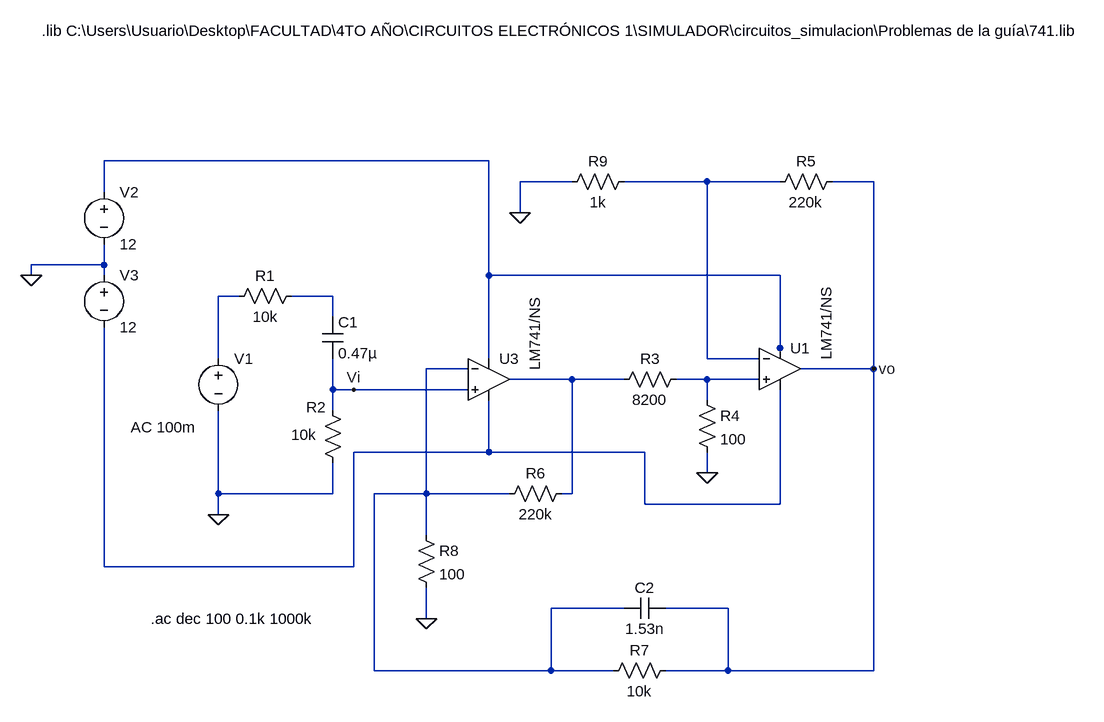
[diagram p0: schematic circuito.asc]
circuito.asc, the LTspice schematic file:
Version 4
SHEET 1 1612 680
WIRE 576 -176 -16 -176
WIRE 704 -144 624 -144
WIRE 912 -144 784 -144
WIRE 1024 -144 912 -144
WIRE 1168 -144 1104 -144
WIRE -16 -128 -16 -176
WIRE 624 -96 624 -144
WIRE -16 -16 -16 -48
WIRE -16 -16 -128 -16
WIRE -128 0 -128 -16
WIRE -16 0 -16 -16
WIRE 576 0 576 -176
WIRE 1024 0 576 0
WIRE 192 32 160 32
WIRE 336 32 272 32
WIRE 336 64 336 32
WIRE 1024 112 1024 0
WIRE 160 128 160 32
WIRE 576 128 576 0
WIRE 912 128 912 -144
WIRE 992 128 912 128
WIRE 1024 128 1024 112
WIRE 544 144 480 144
WIRE 1168 144 1168 -144
WIRE 1168 144 1056 144
WIRE 704 160 608 160
WIRE 784 160 704 160
WIRE 912 160 864 160
WIRE 992 160 912 160
WIRE 336 176 336 128
WIRE 368 176 336 176
WIRE 544 176 368 176
WIRE 912 192 912 160
WIRE 336 208 336 176
WIRE 576 272 576 192
WIRE 576 272 368 272
WIRE 816 272 576 272
WIRE 912 304 912 272
WIRE 160 336 160 208
WIRE 336 336 336 288
WIRE 336 336 160 336
WIRE 480 336 480 144
WIRE 480 336 400 336
WIRE 608 336 480 336
WIRE 704 336 704 160
WIRE 704 336 688 336
WIRE 816 352 816 272
WIRE 1024 352 1024 176
WIRE 1024 352 816 352
WIRE 160 368 160 336
WIRE 480 400 480 336
WIRE -16 448 -16 80
WIRE 368 448 368 272
WIRE 368 448 -16 448
WIRE 784 512 672 512
WIRE 944 512 848 512
WIRE 480 528 480 480
WIRE 400 608 400 336
WIRE 672 608 672 512
WIRE 672 608 400 608
WIRE 768 608 672 608
WIRE 944 608 944 512
WIRE 944 608 848 608
WIRE 1168 608 1168 144
WIRE 1168 608 944 608
FLAG 160 368 0
FLAG 912 304 0
FLAG 624 -96 0
FLAG 480 528 0
FLAG 368 176 Vi
FLAG -128 0 0
FLAG 1168 144 vo
SYMBOL voltage 160 112 R0
WINDOW 123 -135 122 Left 2
WINDOW 39 0 0 Left 0
SYMATTR Value2 AC 100m
SYMATTR InstName V1
SYMATTR Value ""
SYMBOL res 288 16 R90
WINDOW 0 0 56 VBottom 2
WINDOW 3 32 56 VTop 2
SYMATTR InstName R1
SYMATTR Value 10k
SYMBOL res 320 192 R0
WINDOW 0 -25 11 Left 2
WINDOW 3 -48 53 Left 2
SYMATTR InstName R2
SYMATTR Value 10k
SYMBOL cap 320 64 R0
SYMATTR InstName C1
SYMATTR Value 0.47µ
SYMBOL res 880 144 R90
WINDOW 0 0 56 VBottom 2
WINDOW 3 32 56 VTop 2
SYMATTR InstName R3
SYMATTR Value 8200
SYMBOL res 1120 -160 R90
WINDOW 0 0 56 VBottom 2
WINDOW 3 32 56 VTop 2
SYMATTR InstName R5
SYMATTR Value 220k
SYMBOL res 704 320 R90
WINDOW 0 0 56 VBottom 2
WINDOW 3 32 56 VTop 2
SYMATTR InstName R6
SYMATTR Value 220k
SYMBOL res 864 592 R90
WINDOW 0 0 56 VBottom 2
WINDOW 3 32 56 VTop 2
SYMATTR InstName R7
SYMATTR Value 10k
SYMBOL res 464 384 R0
SYMATTR InstName R8
SYMATTR Value 100
SYMBOL res 896 176 R0
SYMATTR InstName R4
SYMATTR Value 100
SYMBOL res 800 -160 R90
WINDOW 0 0 56 VBottom 2
WINDOW 3 32 56 VTop 2
SYMATTR InstName R9
SYMATTR Value 1k
SYMBOL OpAmps\\opamp2 576 96 R0
WINDOW 3 71 50 VLeft 2
SYMATTR Value LM741/NS
SYMATTR InstName U3
SYMBOL voltage -16 -144 R0
WINDOW 123 0 0 Left 0
WINDOW 39 0 0 Left 0
SYMATTR InstName V2
SYMATTR Value 12
SYMBOL voltage -16 -16 R0
WINDOW 123 0 0 Left 0
WINDOW 39 0 0 Left 0
SYMATTR InstName V3
SYMATTR Value 12
SYMBOL OpAmps\\opamp2 1024 80 R0
WINDOW 3 71 50 VLeft 2
SYMATTR Value LM741/NS
SYMATTR InstName U1
SYMBOL cap 848 496 R90
WINDOW 0 0 32 VBottom 2
WINDOW 3 32 32 VTop 2
SYMATTR InstName C2
SYMATTR Value 1.53n
TEXT 56 528 Left 2 !.ac dec 100 0.1k 1000k
TEXT -112 -376 Left 2 !.lib C:\\Users\\Usuario\\Desktop\\FACULTAD\\4TO AÑO\\CIRCUITOS ELECTRÓNICOS 1\\SIMULADOR\\circuitos_simulacion\\Problemas de la guía\\741.lib

The netlist it stands for:
* circuito.asc
V1 N003 0 AC 100m
R1 N004 N003 10k
R2 Vi 0 10k
C1 N004 Vi 0.47µ
R3 N007 N006 8200
R5 vo N002 220k
R6 N006 N005 220k
R7 vo N005 10k
R8 N005 0 100
R4 N007 0 100
R9 N002 0 1k
XU3 Vi N005 N001 N008 N006 LM741/NS  ; pins In+ In- V+ V- OUT
V2 N001 0 12
V3 0 N008 12
XU1 N007 N002 N001 N008 vo LM741/NS  ; pins In+ In- V+ V- OUT
C2 vo N005 1.53n
.ac dec 100 0.1k 1000k
.lib C:\Users\Usuario\Desktop\FACULTAD\4TO AÑO\CIRCUITOS ELECTRÓNICOS 1\SIMULADOR\circuitos_simulacion\Problemas de la guía\741.lib
.backanno
.end